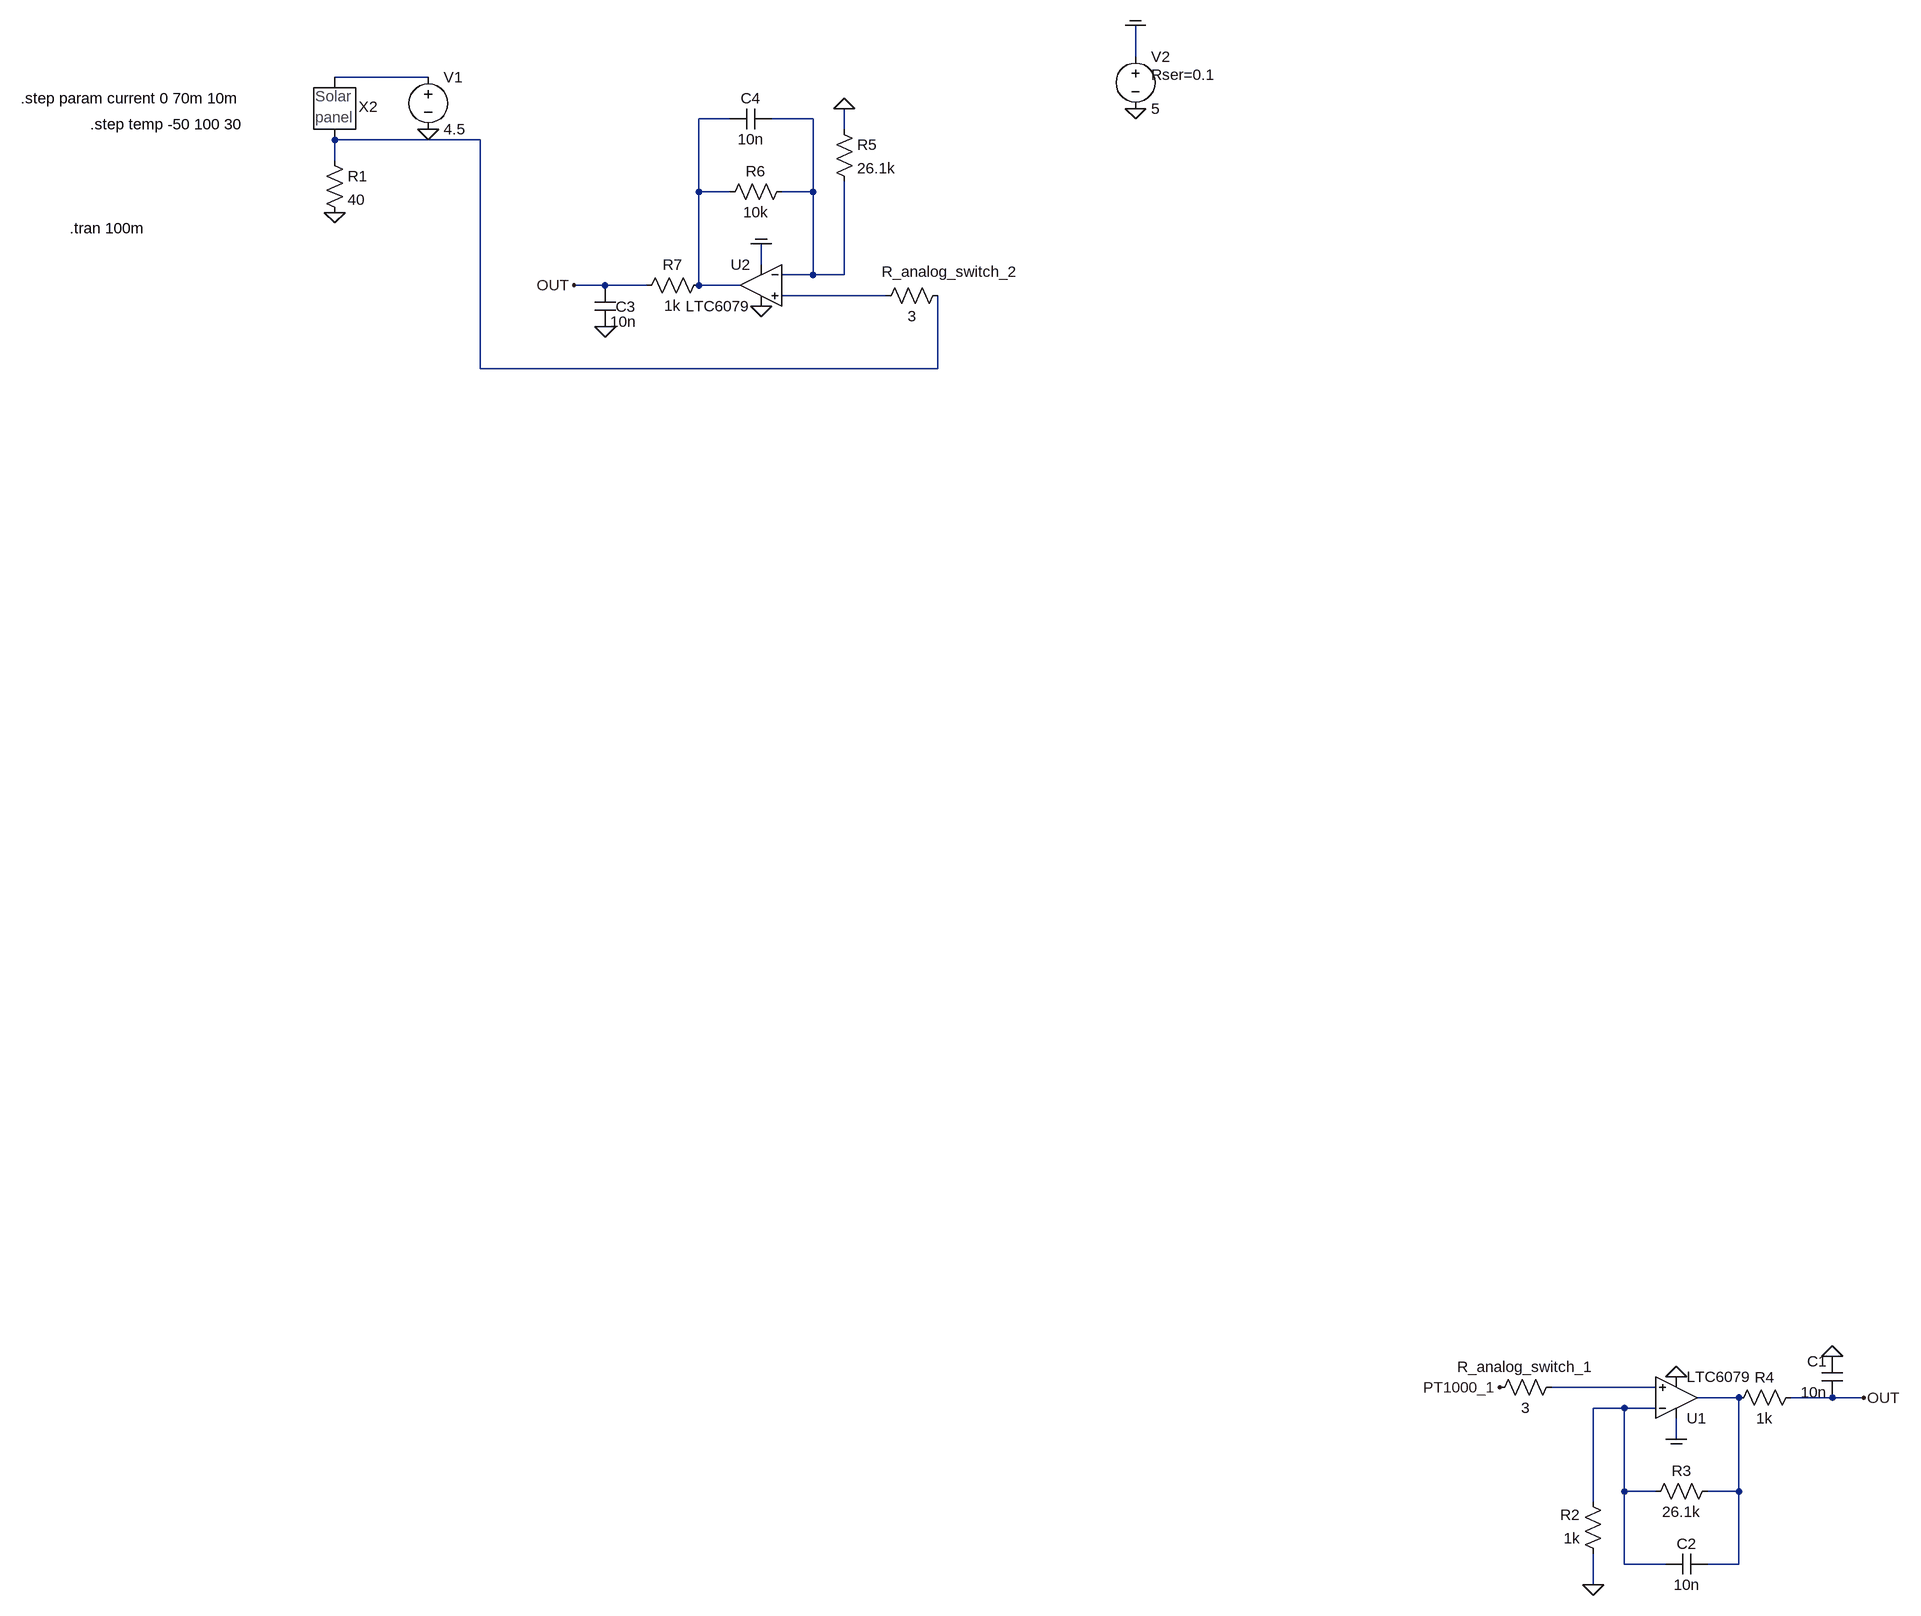
[diagram p0: schematic Uklad.asc]
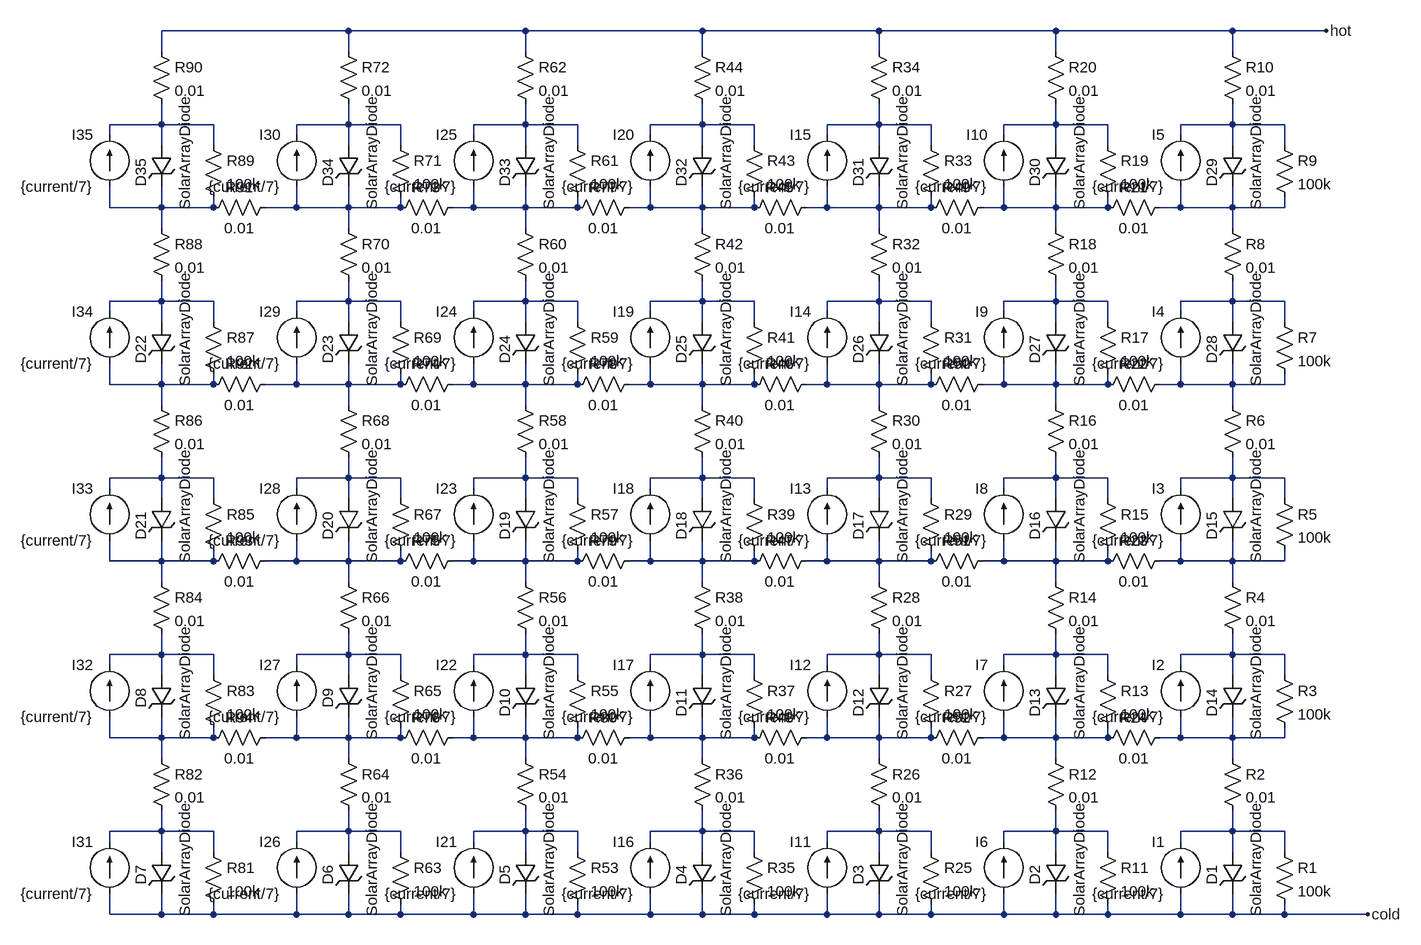
[diagram p1: sub-circuit solar.asc]
Uklad.asc, the LTspice schematic file:
Version 4
SHEET 1 2604 2436
WIRE 1408 64 1408 16
WIRE 320 96 176 96
WIRE 784 160 736 160
WIRE 912 160 848 160
WIRE 960 176 960 144
WIRE 400 192 176 192
WIRE 176 224 176 192
WIRE 736 272 736 160
WIRE 784 272 736 272
WIRE 912 272 912 160
WIRE 912 272 864 272
WIRE 832 384 832 352
WIRE 912 400 912 272
WIRE 912 400 864 400
WIRE 960 400 960 256
WIRE 960 400 912 400
WIRE 592 416 544 416
WIRE 656 416 592 416
WIRE 736 416 736 272
WIRE 800 416 736 416
WIRE 1024 432 864 432
WIRE 400 544 400 192
WIRE 1104 544 1104 432
WIRE 1104 544 400 544
WIRE 2208 2112 2048 2112
WIRE 2336 2128 2272 2128
WIRE 2480 2128 2416 2128
WIRE 2528 2128 2480 2128
WIRE 2160 2144 2112 2144
WIRE 2208 2144 2160 2144
WIRE 2240 2192 2240 2160
WIRE 2160 2272 2160 2144
WIRE 2208 2272 2160 2272
WIRE 2336 2272 2336 2128
WIRE 2336 2272 2288 2272
WIRE 2112 2288 2112 2144
WIRE 2160 2384 2160 2272
WIRE 2224 2384 2160 2384
WIRE 2336 2384 2336 2272
WIRE 2336 2384 2288 2384
WIRE 2112 2416 2112 2368
FLAG 176 304 0
FLAG 320 176 0
FLAG 2240 2096 0
FLAG 2240 2192 COM
FLAG 2112 2416 0
FLAG 2480 2064 0
FLAG 1968 2112 PT1000_1
FLAG 2528 2128 OUT
FLAG 832 448 0
FLAG 832 352 COM
FLAG 960 144 0
FLAG 592 480 0
FLAG 544 416 OUT
FLAG 1408 144 0
FLAG 1408 16 COM
SYMBOL voltage 320 80 R0
WINDOW 123 0 0 Left 2
WINDOW 39 0 0 Left 2
SYMATTR InstName V1
SYMATTR Value 4.5
SYMBOL SOLAR 176 144 R0
SYMATTR InstName X2
SYMBOL res 160 208 R0
SYMATTR InstName R1
SYMATTR Value 40
SYMBOL Opamps\\LTC6079 2240 2128 M180
SYMATTR InstName U1
SYMBOL res 2128 2384 R180
WINDOW 0 36 76 Left 2
WINDOW 3 36 40 Left 2
SYMATTR InstName R2
SYMATTR Value 1k
SYMBOL res 2192 2288 R270
WINDOW 0 32 56 VTop 2
WINDOW 3 0 56 VBottom 2
SYMATTR InstName R3
SYMATTR Value 26.1k
SYMBOL cap 2496 2128 R180
WINDOW 0 24 56 Left 2
WINDOW 3 24 8 Left 2
SYMATTR InstName C1
SYMATTR Value 10n
SYMBOL res 2320 2144 R270
WINDOW 0 32 56 VTop 2
WINDOW 3 0 56 VBottom 2
SYMATTR InstName R4
SYMATTR Value 1k
SYMBOL res 1952 2128 R270
WINDOW 0 32 56 VTop 2
WINDOW 3 0 56 VBottom 2
SYMATTR InstName R_analog_switch_1
SYMATTR Value 3
SYMBOL cap 2224 2400 R270
WINDOW 0 32 32 VTop 2
WINDOW 3 0 32 VBottom 2
SYMATTR InstName C2
SYMATTR Value 10n
SYMBOL Opamps\\LTC6079 832 416 M0
SYMATTR InstName U2
SYMBOL res 944 160 R0
SYMATTR InstName R5
SYMATTR Value 26.1k
SYMBOL res 880 256 R90
WINDOW 0 0 56 VBottom 2
WINDOW 3 32 56 VTop 2
SYMATTR InstName R6
SYMATTR Value 10k
SYMBOL cap 576 416 R0
WINDOW 0 32 33 Left 2
SYMATTR InstName C3
SYMATTR Value 10n
SYMBOL res 752 400 R90
WINDOW 0 0 56 VBottom 2
WINDOW 3 32 56 VTop 2
SYMATTR InstName R7
SYMATTR Value 1k
SYMBOL res 1120 416 R90
WINDOW 0 -5 -3 VBottom 2
WINDOW 3 32 56 VTop 2
SYMATTR InstName R_analog_switch_2
SYMATTR Value 3
SYMBOL cap 848 144 R90
WINDOW 0 0 32 VBottom 2
WINDOW 3 32 32 VTop 2
SYMATTR InstName C4
SYMATTR Value 10n
SYMBOL voltage 1408 48 R0
WINDOW 123 0 0 Left 2
WINDOW 39 24 44 Left 2
SYMATTR SpiceLine Rser=0.1
SYMATTR InstName V2
SYMATTR Value 5
TEXT 32 128 Right 2 !.step param current 0 70m 10m
TEXT -200 168 Left 2 !.step temp -50 100 30
TEXT -232 328 Left 2 !.tran 100m

solar.asc, the sub-circuit schematic file:
Version 4
SHEET 1 880 680
WIRE -1744 -1248 -2032 -1248
WIRE -1472 -1248 -1744 -1248
WIRE -1200 -1248 -1472 -1248
WIRE -928 -1248 -1200 -1248
WIRE -656 -1248 -928 -1248
WIRE -384 -1248 -656 -1248
WIRE -240 -1248 -384 -1248
WIRE -2032 -1216 -2032 -1248
WIRE -1744 -1216 -1744 -1248
WIRE -1472 -1216 -1472 -1248
WIRE -1200 -1216 -1200 -1248
WIRE -928 -1216 -928 -1248
WIRE -656 -1216 -656 -1248
WIRE -384 -1216 -384 -1248
WIRE -2032 -1104 -2032 -1136
WIRE -2032 -1104 -2112 -1104
WIRE -1952 -1104 -2032 -1104
WIRE -1744 -1104 -1744 -1136
WIRE -1744 -1104 -1824 -1104
WIRE -1664 -1104 -1744 -1104
WIRE -1472 -1104 -1472 -1136
WIRE -1472 -1104 -1552 -1104
WIRE -1392 -1104 -1472 -1104
WIRE -1200 -1104 -1200 -1136
WIRE -1200 -1104 -1280 -1104
WIRE -1120 -1104 -1200 -1104
WIRE -928 -1104 -928 -1136
WIRE -928 -1104 -1008 -1104
WIRE -848 -1104 -928 -1104
WIRE -656 -1104 -656 -1136
WIRE -656 -1104 -736 -1104
WIRE -576 -1104 -656 -1104
WIRE -384 -1104 -384 -1136
WIRE -384 -1104 -464 -1104
WIRE -304 -1104 -384 -1104
WIRE -2112 -1088 -2112 -1104
WIRE -1824 -1088 -1824 -1104
WIRE -1552 -1088 -1552 -1104
WIRE -1280 -1088 -1280 -1104
WIRE -1008 -1088 -1008 -1104
WIRE -736 -1088 -736 -1104
WIRE -464 -1088 -464 -1104
WIRE -2032 -1072 -2032 -1104
WIRE -1952 -1072 -1952 -1104
WIRE -1744 -1072 -1744 -1104
WIRE -1664 -1072 -1664 -1104
WIRE -1472 -1072 -1472 -1104
WIRE -1392 -1072 -1392 -1104
WIRE -1200 -1072 -1200 -1104
WIRE -1120 -1072 -1120 -1104
WIRE -928 -1072 -928 -1104
WIRE -848 -1072 -848 -1104
WIRE -656 -1072 -656 -1104
WIRE -576 -1072 -576 -1104
WIRE -384 -1072 -384 -1104
WIRE -304 -1072 -304 -1104
WIRE -2112 -976 -2112 -1008
WIRE -2032 -976 -2032 -1008
WIRE -2032 -976 -2112 -976
WIRE -1952 -976 -1952 -992
WIRE -1952 -976 -2032 -976
WIRE -1824 -976 -1824 -1008
WIRE -1824 -976 -1872 -976
WIRE -1744 -976 -1744 -1008
WIRE -1744 -976 -1824 -976
WIRE -1664 -976 -1664 -992
WIRE -1664 -976 -1744 -976
WIRE -1552 -976 -1552 -1008
WIRE -1552 -976 -1584 -976
WIRE -1472 -976 -1472 -1008
WIRE -1472 -976 -1552 -976
WIRE -1392 -976 -1392 -992
WIRE -1392 -976 -1472 -976
WIRE -1280 -976 -1280 -1008
WIRE -1280 -976 -1312 -976
WIRE -1200 -976 -1200 -1008
WIRE -1200 -976 -1280 -976
WIRE -1120 -976 -1120 -992
WIRE -1120 -976 -1200 -976
WIRE -1008 -976 -1008 -1008
WIRE -1008 -976 -1040 -976
WIRE -928 -976 -928 -1008
WIRE -928 -976 -1008 -976
WIRE -848 -976 -848 -992
WIRE -848 -976 -928 -976
WIRE -736 -976 -736 -1008
WIRE -736 -976 -768 -976
WIRE -656 -976 -656 -1008
WIRE -656 -976 -736 -976
WIRE -576 -976 -576 -992
WIRE -576 -976 -656 -976
WIRE -464 -976 -464 -1008
WIRE -464 -976 -496 -976
WIRE -384 -976 -384 -1008
WIRE -384 -976 -464 -976
WIRE -304 -976 -304 -992
WIRE -304 -976 -384 -976
WIRE -2032 -944 -2032 -976
WIRE -1744 -944 -1744 -976
WIRE -1472 -944 -1472 -976
WIRE -1200 -944 -1200 -976
WIRE -928 -944 -928 -976
WIRE -656 -944 -656 -976
WIRE -384 -944 -384 -976
WIRE -2032 -832 -2032 -864
WIRE -2032 -832 -2112 -832
WIRE -1952 -832 -2032 -832
WIRE -1744 -832 -1744 -864
WIRE -1744 -832 -1824 -832
WIRE -1664 -832 -1744 -832
WIRE -1472 -832 -1472 -864
WIRE -1472 -832 -1552 -832
WIRE -1392 -832 -1472 -832
WIRE -1200 -832 -1200 -864
WIRE -1200 -832 -1280 -832
WIRE -1120 -832 -1200 -832
WIRE -928 -832 -928 -864
WIRE -928 -832 -1008 -832
WIRE -848 -832 -928 -832
WIRE -656 -832 -656 -864
WIRE -656 -832 -736 -832
WIRE -576 -832 -656 -832
WIRE -384 -832 -384 -864
WIRE -384 -832 -464 -832
WIRE -304 -832 -384 -832
WIRE -2112 -816 -2112 -832
WIRE -1824 -816 -1824 -832
WIRE -1552 -816 -1552 -832
WIRE -1280 -816 -1280 -832
WIRE -1008 -816 -1008 -832
WIRE -736 -816 -736 -832
WIRE -464 -816 -464 -832
WIRE -2032 -800 -2032 -832
WIRE -1952 -800 -1952 -832
WIRE -1744 -800 -1744 -832
WIRE -1664 -800 -1664 -832
WIRE -1472 -800 -1472 -832
WIRE -1392 -800 -1392 -832
WIRE -1200 -800 -1200 -832
WIRE -1120 -800 -1120 -832
WIRE -928 -800 -928 -832
WIRE -848 -800 -848 -832
WIRE -656 -800 -656 -832
WIRE -576 -800 -576 -832
WIRE -384 -800 -384 -832
WIRE -304 -800 -304 -832
WIRE -2112 -704 -2112 -736
WIRE -2032 -704 -2032 -736
WIRE -2032 -704 -2112 -704
WIRE -1952 -704 -1952 -720
WIRE -1952 -704 -2032 -704
WIRE -1824 -704 -1824 -736
WIRE -1824 -704 -1872 -704
WIRE -1744 -704 -1744 -736
WIRE -1744 -704 -1824 -704
WIRE -1664 -704 -1664 -720
WIRE -1664 -704 -1744 -704
WIRE -1552 -704 -1552 -736
WIRE -1552 -704 -1584 -704
WIRE -1472 -704 -1472 -736
WIRE -1472 -704 -1552 -704
WIRE -1392 -704 -1392 -720
WIRE -1392 -704 -1472 -704
WIRE -1280 -704 -1280 -736
WIRE -1280 -704 -1312 -704
WIRE -1200 -704 -1200 -736
WIRE -1200 -704 -1280 -704
WIRE -1120 -704 -1120 -720
WIRE -1120 -704 -1200 -704
WIRE -1008 -704 -1008 -736
WIRE -1008 -704 -1040 -704
WIRE -928 -704 -928 -736
WIRE -928 -704 -1008 -704
WIRE -848 -704 -848 -720
WIRE -848 -704 -928 -704
WIRE -736 -704 -736 -736
WIRE -736 -704 -768 -704
WIRE -656 -704 -656 -736
WIRE -656 -704 -736 -704
WIRE -576 -704 -576 -720
WIRE -576 -704 -656 -704
WIRE -464 -704 -464 -736
WIRE -464 -704 -496 -704
WIRE -384 -704 -384 -736
WIRE -384 -704 -464 -704
WIRE -304 -704 -304 -720
WIRE -304 -704 -384 -704
WIRE -2032 -672 -2032 -704
WIRE -1744 -672 -1744 -704
WIRE -1472 -672 -1472 -704
WIRE -1200 -672 -1200 -704
WIRE -928 -672 -928 -704
WIRE -656 -672 -656 -704
WIRE -384 -672 -384 -704
WIRE -2032 -560 -2032 -592
WIRE -2032 -560 -2112 -560
WIRE -1952 -560 -2032 -560
WIRE -1744 -560 -1744 -592
WIRE -1744 -560 -1824 -560
WIRE -1664 -560 -1744 -560
WIRE -1472 -560 -1472 -592
WIRE -1472 -560 -1552 -560
WIRE -1392 -560 -1472 -560
WIRE -1200 -560 -1200 -592
WIRE -1200 -560 -1280 -560
WIRE -1120 -560 -1200 -560
WIRE -928 -560 -928 -592
WIRE -928 -560 -1008 -560
WIRE -848 -560 -928 -560
WIRE -656 -560 -656 -592
WIRE -656 -560 -736 -560
WIRE -576 -560 -656 -560
WIRE -384 -560 -384 -592
WIRE -384 -560 -464 -560
WIRE -304 -560 -384 -560
WIRE -2112 -544 -2112 -560
WIRE -1824 -544 -1824 -560
WIRE -1552 -544 -1552 -560
WIRE -1280 -544 -1280 -560
WIRE -1008 -544 -1008 -560
WIRE -736 -544 -736 -560
WIRE -464 -544 -464 -560
WIRE -2032 -528 -2032 -560
WIRE -1952 -528 -1952 -560
WIRE -1744 -528 -1744 -560
WIRE -1664 -528 -1664 -560
WIRE -1472 -528 -1472 -560
WIRE -1392 -528 -1392 -560
WIRE -1200 -528 -1200 -560
WIRE -1120 -528 -1120 -560
WIRE -928 -528 -928 -560
WIRE -848 -528 -848 -560
WIRE -656 -528 -656 -560
WIRE -576 -528 -576 -560
WIRE -384 -528 -384 -560
WIRE -304 -528 -304 -560
WIRE -2112 -432 -2112 -464
WIRE -2032 -432 -2032 -464
WIRE -2032 -432 -2112 -432
WIRE -1952 -432 -1952 -448
WIRE -1952 -432 -2032 -432
WIRE -1824 -432 -1824 -464
WIRE -1824 -432 -1872 -432
WIRE -1744 -432 -1744 -464
WIRE -1744 -432 -1824 -432
WIRE -1664 -432 -1664 -448
WIRE -1664 -432 -1744 -432
WIRE -1552 -432 -1552 -464
WIRE -1552 -432 -1584 -432
WIRE -1472 -432 -1472 -464
WIRE -1472 -432 -1552 -432
WIRE -1392 -432 -1392 -448
WIRE -1392 -432 -1472 -432
WIRE -1280 -432 -1280 -464
WIRE -1280 -432 -1312 -432
WIRE -1200 -432 -1200 -464
WIRE -1200 -432 -1280 -432
WIRE -1120 -432 -1120 -448
WIRE -1120 -432 -1200 -432
WIRE -1008 -432 -1008 -464
WIRE -1008 -432 -1040 -432
WIRE -928 -432 -928 -464
WIRE -928 -432 -1008 -432
WIRE -848 -432 -848 -448
WIRE -848 -432 -928 -432
WIRE -736 -432 -736 -464
WIRE -736 -432 -768 -432
WIRE -656 -432 -656 -464
WIRE -656 -432 -736 -432
WIRE -576 -432 -576 -448
WIRE -576 -432 -656 -432
WIRE -464 -432 -464 -464
WIRE -464 -432 -496 -432
WIRE -384 -432 -384 -464
WIRE -384 -432 -464 -432
WIRE -304 -432 -304 -448
WIRE -304 -432 -384 -432
WIRE -2032 -400 -2032 -432
WIRE -1744 -400 -1744 -432
WIRE -1472 -400 -1472 -432
WIRE -1200 -400 -1200 -432
WIRE -928 -400 -928 -432
WIRE -656 -400 -656 -432
WIRE -384 -400 -384 -432
WIRE -2032 -288 -2032 -320
WIRE -2032 -288 -2112 -288
WIRE -1952 -288 -2032 -288
WIRE -1744 -288 -1744 -320
WIRE -1744 -288 -1824 -288
WIRE -1664 -288 -1744 -288
WIRE -1472 -288 -1472 -320
WIRE -1472 -288 -1552 -288
WIRE -1392 -288 -1472 -288
WIRE -1200 -288 -1200 -320
WIRE -1200 -288 -1280 -288
WIRE -1120 -288 -1200 -288
WIRE -928 -288 -928 -320
WIRE -928 -288 -1008 -288
WIRE -848 -288 -928 -288
WIRE -656 -288 -656 -320
WIRE -656 -288 -736 -288
WIRE -576 -288 -656 -288
WIRE -384 -288 -384 -320
WIRE -384 -288 -464 -288
WIRE -304 -288 -384 -288
WIRE -2112 -272 -2112 -288
WIRE -1824 -272 -1824 -288
WIRE -1552 -272 -1552 -288
WIRE -1280 -272 -1280 -288
WIRE -1008 -272 -1008 -288
WIRE -736 -272 -736 -288
WIRE -464 -272 -464 -288
WIRE -2032 -256 -2032 -288
WIRE -1952 -256 -1952 -288
WIRE -1744 -256 -1744 -288
WIRE -1664 -256 -1664 -288
WIRE -1472 -256 -1472 -288
WIRE -1392 -256 -1392 -288
WIRE -1200 -256 -1200 -288
WIRE -1120 -256 -1120 -288
WIRE -928 -256 -928 -288
WIRE -848 -256 -848 -288
WIRE -656 -256 -656 -288
WIRE -576 -256 -576 -288
WIRE -384 -256 -384 -288
WIRE -304 -256 -304 -288
WIRE -2112 -160 -2112 -192
WIRE -2032 -160 -2032 -192
WIRE -2032 -160 -2112 -160
WIRE -1952 -160 -1952 -176
WIRE -1952 -160 -2032 -160
WIRE -1824 -160 -1824 -192
WIRE -1824 -160 -1872 -160
WIRE -1744 -160 -1744 -192
WIRE -1744 -160 -1824 -160
WIRE -1664 -160 -1664 -176
WIRE -1664 -160 -1744 -160
WIRE -1552 -160 -1552 -192
WIRE -1552 -160 -1584 -160
WIRE -1472 -160 -1472 -192
WIRE -1472 -160 -1552 -160
WIRE -1392 -160 -1392 -176
WIRE -1392 -160 -1472 -160
WIRE -1280 -160 -1280 -192
WIRE -1280 -160 -1312 -160
WIRE -1200 -160 -1200 -192
WIRE -1200 -160 -1280 -160
WIRE -1120 -160 -1120 -176
WIRE -1120 -160 -1200 -160
WIRE -1008 -160 -1008 -192
WIRE -1008 -160 -1040 -160
WIRE -928 -160 -928 -192
WIRE -928 -160 -1008 -160
WIRE -848 -160 -848 -176
WIRE -848 -160 -928 -160
WIRE -736 -160 -736 -192
WIRE -736 -160 -768 -160
WIRE -656 -160 -656 -192
WIRE -656 -160 -736 -160
WIRE -576 -160 -576 -176
WIRE -576 -160 -656 -160
WIRE -464 -160 -464 -192
WIRE -464 -160 -496 -160
WIRE -384 -160 -384 -192
WIRE -384 -160 -464 -160
WIRE -304 -160 -304 -176
WIRE -304 -160 -384 -160
WIRE -2032 -128 -2032 -160
WIRE -1744 -128 -1744 -160
WIRE -1472 -128 -1472 -160
WIRE -1200 -128 -1200 -160
WIRE -928 -128 -928 -160
WIRE -656 -128 -656 -160
WIRE -384 -128 -384 -160
WIRE -2032 -16 -2032 -48
WIRE -2032 -16 -2112 -16
WIRE -1952 -16 -2032 -16
WIRE -1744 -16 -1744 -48
WIRE -1744 -16 -1824 -16
WIRE -1664 -16 -1744 -16
WIRE -1472 -16 -1472 -48
WIRE -1472 -16 -1552 -16
WIRE -1392 -16 -1472 -16
WIRE -1200 -16 -1200 -48
WIRE -1200 -16 -1280 -16
WIRE -1120 -16 -1200 -16
WIRE -928 -16 -928 -48
WIRE -928 -16 -1008 -16
WIRE -848 -16 -928 -16
WIRE -656 -16 -656 -48
WIRE -656 -16 -736 -16
WIRE -576 -16 -656 -16
WIRE -384 -16 -384 -48
WIRE -384 -16 -464 -16
WIRE -304 -16 -384 -16
WIRE -2112 0 -2112 -16
WIRE -1824 0 -1824 -16
WIRE -1552 0 -1552 -16
WIRE -1280 0 -1280 -16
WIRE -1008 0 -1008 -16
WIRE -736 0 -736 -16
WIRE -464 0 -464 -16
WIRE -2032 16 -2032 -16
WIRE -1952 16 -1952 -16
WIRE -1744 16 -1744 -16
WIRE -1664 16 -1664 -16
WIRE -1472 16 -1472 -16
WIRE -1392 16 -1392 -16
WIRE -1200 16 -1200 -16
WIRE -1120 16 -1120 -16
WIRE -928 16 -928 -16
WIRE -848 16 -848 -16
WIRE -656 16 -656 -16
WIRE -576 16 -576 -16
WIRE -384 16 -384 -16
WIRE -304 16 -304 -16
WIRE -2112 112 -2112 80
WIRE -2032 112 -2032 80
WIRE -2032 112 -2112 112
WIRE -1952 112 -1952 96
WIRE -1952 112 -2032 112
WIRE -1824 112 -1824 80
WIRE -1824 112 -1952 112
WIRE -1744 112 -1744 80
WIRE -1744 112 -1824 112
WIRE -1664 112 -1664 96
WIRE -1664 112 -1744 112
WIRE -1552 112 -1552 80
WIRE -1552 112 -1664 112
WIRE -1472 112 -1472 80
WIRE -1472 112 -1552 112
WIRE -1392 112 -1392 96
WIRE -1392 112 -1472 112
WIRE -1280 112 -1280 80
WIRE -1280 112 -1392 112
WIRE -1200 112 -1200 80
WIRE -1200 112 -1280 112
WIRE -1120 112 -1120 96
WIRE -1120 112 -1200 112
WIRE -1008 112 -1008 80
WIRE -1008 112 -1120 112
WIRE -928 112 -928 80
WIRE -928 112 -1008 112
WIRE -848 112 -848 96
WIRE -848 112 -928 112
WIRE -736 112 -736 80
WIRE -736 112 -848 112
WIRE -656 112 -656 80
WIRE -656 112 -736 112
WIRE -576 112 -576 96
WIRE -576 112 -656 112
WIRE -464 112 -464 80
WIRE -464 112 -576 112
WIRE -384 112 -384 80
WIRE -384 112 -464 112
WIRE -304 112 -304 96
WIRE -304 112 -384 112
WIRE -176 112 -304 112
FLAG -240 -1248 hot
FLAG -176 112 cold
SYMBOL current -464 80 R180
WINDOW 0 24 80 Left 2
WINDOW 3 24 0 Left 2
WINDOW 123 0 0 Left 2
WINDOW 39 0 0 Left 2
SYMATTR InstName I1
SYMATTR Value {current/7}
SYMBOL zener -400 16 R0
WINDOW 0 -16 20 VRight 2
WINDOW 3 52 99 VLeft 2
SYMATTR InstName D1
SYMATTR Value SolarArrayDiode
SYMATTR Description Diode
SYMATTR Type diode
SYMBOL res -320 0 R0
SYMATTR InstName R1
SYMATTR Value 100k
SYMBOL res -400 -144 R0
SYMATTR InstName R2
SYMATTR Value 0.01
SYMBOL current -464 -192 R180
WINDOW 0 24 80 Left 2
WINDOW 3 24 0 Left 2
WINDOW 123 0 0 Left 2
WINDOW 39 0 0 Left 2
SYMATTR InstName I2
SYMATTR Value {current/7}
SYMBOL res -320 -272 R0
SYMATTR InstName R3
SYMATTR Value 100k
SYMBOL res -400 -416 R0
SYMATTR InstName R4
SYMATTR Value 0.01
SYMBOL current -464 -464 R180
WINDOW 0 24 80 Left 2
WINDOW 3 24 0 Left 2
WINDOW 123 0 0 Left 2
WINDOW 39 0 0 Left 2
SYMATTR InstName I3
SYMATTR Value {current/7}
SYMBOL res -320 -544 R0
SYMATTR InstName R5
SYMATTR Value 100k
SYMBOL res -400 -688 R0
SYMATTR InstName R6
SYMATTR Value 0.01
SYMBOL current -464 -736 R180
WINDOW 0 24 80 Left 2
WINDOW 3 24 0 Left 2
WINDOW 123 0 0 Left 2
WINDOW 39 0 0 Left 2
SYMATTR InstName I4
SYMATTR Value {current/7}
SYMBOL res -320 -816 R0
SYMATTR InstName R7
SYMATTR Value 100k
SYMBOL res -400 -960 R0
SYMATTR InstName R8
SYMATTR Value 0.01
SYMBOL current -464 -1008 R180
WINDOW 0 24 80 Left 2
WINDOW 3 24 0 Left 2
WINDOW 123 0 0 Left 2
WINDOW 39 0 0 Left 2
SYMATTR InstName I5
SYMATTR Value {current/7}
SYMBOL res -320 -1088 R0
SYMATTR InstName R9
SYMATTR Value 100k
SYMBOL res -400 -1232 R0
SYMATTR InstName R10
SYMATTR Value 0.01
SYMBOL current -736 80 R180
WINDOW 0 24 80 Left 2
WINDOW 3 24 0 Left 2
WINDOW 123 0 0 Left 2
WINDOW 39 0 0 Left 2
SYMATTR InstName I6
SYMATTR Value {current/7}
SYMBOL zener -672 16 R0
WINDOW 0 -16 20 VRight 2
WINDOW 3 52 99 VLeft 2
SYMATTR InstName D2
SYMATTR Value SolarArrayDiode
SYMATTR Description Diode
SYMATTR Type diode
SYMBOL res -592 0 R0
SYMATTR InstName R11
SYMATTR Value 100k
SYMBOL res -672 -144 R0
SYMATTR InstName R12
SYMATTR Value 0.01
SYMBOL current -736 -192 R180
WINDOW 0 24 80 Left 2
WINDOW 3 24 0 Left 2
WINDOW 123 0 0 Left 2
WINDOW 39 0 0 Left 2
SYMATTR InstName I7
SYMATTR Value {current/7}
SYMBOL res -592 -272 R0
SYMATTR InstName R13
SYMATTR Value 100k
SYMBOL res -672 -416 R0
SYMATTR InstName R14
SYMATTR Value 0.01
SYMBOL current -736 -464 R180
WINDOW 0 24 80 Left 2
WINDOW 3 24 0 Left 2
WINDOW 123 0 0 Left 2
WINDOW 39 0 0 Left 2
SYMATTR InstName I8
SYMATTR Value {current/7}
SYMBOL res -592 -544 R0
SYMATTR InstName R15
SYMATTR Value 100k
SYMBOL res -672 -688 R0
SYMATTR InstName R16
SYMATTR Value 0.01
SYMBOL current -736 -736 R180
WINDOW 0 24 80 Left 2
WINDOW 3 24 0 Left 2
WINDOW 123 0 0 Left 2
WINDOW 39 0 0 Left 2
SYMATTR InstName I9
SYMATTR Value {current/7}
SYMBOL res -592 -816 R0
SYMATTR InstName R17
SYMATTR Value 100k
SYMBOL res -672 -960 R0
SYMATTR InstName R18
SYMATTR Value 0.01
SYMBOL current -736 -1008 R180
WINDOW 0 24 80 Left 2
WINDOW 3 24 0 Left 2
WINDOW 123 0 0 Left 2
WINDOW 39 0 0 Left 2
SYMATTR InstName I10
SYMATTR Value {current/7}
SYMBOL res -592 -1088 R0
SYMATTR InstName R19
SYMATTR Value 100k
SYMBOL res -672 -1232 R0
SYMATTR InstName R20
SYMATTR Value 0.01
SYMBOL res -480 -992 R90
WINDOW 0 0 56 VBottom 2
WINDOW 3 32 56 VTop 2
SYMATTR InstName R21
SYMATTR Value 0.01
SYMBOL res -480 -720 R90
WINDOW 0 0 56 VBottom 2
WINDOW 3 32 56 VTop 2
SYMATTR InstName R22
SYMATTR Value 0.01
SYMBOL res -480 -448 R90
WINDOW 0 0 56 VBottom 2
WINDOW 3 32 56 VTop 2
SYMATTR InstName R23
SYMATTR Value 0.01
SYMBOL res -480 -176 R90
WINDOW 0 0 56 VBottom 2
WINDOW 3 32 56 VTop 2
SYMATTR InstName R24
SYMATTR Value 0.01
SYMBOL current -1008 80 R180
WINDOW 0 24 80 Left 2
WINDOW 3 24 0 Left 2
WINDOW 123 0 0 Left 2
WINDOW 39 0 0 Left 2
SYMATTR InstName I11
SYMATTR Value {current/7}
SYMBOL res -864 0 R0
SYMATTR InstName R25
SYMATTR Value 100k
SYMBOL res -944 -144 R0
SYMATTR InstName R26
SYMATTR Value 0.01
SYMBOL current -1008 -192 R180
WINDOW 0 24 80 Left 2
WINDOW 3 24 0 Left 2
WINDOW 123 0 0 Left 2
WINDOW 39 0 0 Left 2
SYMATTR InstName I12
SYMATTR Value {current/7}
SYMBOL res -864 -272 R0
SYMATTR InstName R27
SYMATTR Value 100k
SYMBOL res -944 -416 R0
SYMATTR InstName R28
SYMATTR Value 0.01
SYMBOL current -1008 -464 R180
WINDOW 0 24 80 Left 2
WINDOW 3 24 0 Left 2
WINDOW 123 0 0 Left 2
WINDOW 39 0 0 Left 2
SYMATTR InstName I13
SYMATTR Value {current/7}
SYMBOL res -864 -544 R0
SYMATTR InstName R29
SYMATTR Value 100k
SYMBOL res -944 -688 R0
SYMATTR InstName R30
SYMATTR Value 0.01
SYMBOL current -1008 -736 R180
WINDOW 0 24 80 Left 2
WINDOW 3 24 0 Left 2
WINDOW 123 0 0 Left 2
WINDOW 39 0 0 Left 2
SYMATTR InstName I14
SYMATTR Value {current/7}
SYMBOL res -864 -816 R0
SYMATTR InstName R31
SYMATTR Value 100k
SYMBOL res -944 -960 R0
SYMATTR InstName R32
SYMATTR Value 0.01
SYMBOL current -1008 -1008 R180
WINDOW 0 24 80 Left 2
WINDOW 3 24 0 Left 2
WINDOW 123 0 0 Left 2
WINDOW 39 0 0 Left 2
SYMATTR InstName I15
SYMATTR Value {current/7}
SYMBOL res -864 -1088 R0
SYMATTR InstName R33
SYMATTR Value 100k
SYMBOL res -944 -1232 R0
SYMATTR InstName R34
SYMATTR Value 0.01
SYMBOL current -1280 80 R180
WINDOW 0 24 80 Left 2
WINDOW 3 24 0 Left 2
WINDOW 123 0 0 Left 2
WINDOW 39 0 0 Left 2
SYMATTR InstName I16
SYMATTR Value {current/7}
SYMBOL res -1136 0 R0
SYMATTR InstName R35
SYMATTR Value 100k
SYMBOL res -1216 -144 R0
SYMATTR InstName R36
SYMATTR Value 0.01
SYMBOL current -1280 -192 R180
WINDOW 0 24 80 Left 2
WINDOW 3 24 0 Left 2
WINDOW 123 0 0 Left 2
WINDOW 39 0 0 Left 2
SYMATTR InstName I17
SYMATTR Value {current/7}
SYMBOL res -1136 -272 R0
SYMATTR InstName R37
SYMATTR Value 100k
SYMBOL res -1216 -416 R0
SYMATTR InstName R38
SYMATTR Value 0.01
SYMBOL current -1280 -464 R180
WINDOW 0 24 80 Left 2
WINDOW 3 24 0 Left 2
WINDOW 123 0 0 Left 2
WINDOW 39 0 0 Left 2
SYMATTR InstName I18
SYMATTR Value {current/7}
SYMBOL res -1136 -544 R0
SYMATTR InstName R39
SYMATTR Value 100k
SYMBOL res -1216 -688 R0
SYMATTR InstName R40
SYMATTR Value 0.01
SYMBOL current -1280 -736 R180
WINDOW 0 24 80 Left 2
WINDOW 3 24 0 Left 2
WINDOW 123 0 0 Left 2
WINDOW 39 0 0 Left 2
SYMATTR InstName I19
SYMATTR Value {current/7}
SYMBOL res -1136 -816 R0
SYMATTR InstName R41
SYMATTR Value 100k
SYMBOL res -1216 -960 R0
SYMATTR InstName R42
SYMATTR Value 0.01
SYMBOL current -1280 -1008 R180
WINDOW 0 24 80 Left 2
WINDOW 3 24 0 Left 2
WINDOW 123 0 0 Left 2
WINDOW 39 0 0 Left 2
SYMATTR InstName I20
SYMATTR Value {current/7}
SYMBOL res -1136 -1088 R0
SYMATTR InstName R43
SYMATTR Value 100k
SYMBOL res -1216 -1232 R0
SYMATTR InstName R44
SYMATTR Value 0.01
SYMBOL res -1024 -992 R90
WINDOW 0 0 56 VBottom 2
WINDOW 3 32 56 VTop 2
SYMATTR InstName R45
SYMATTR Value 0.01
SYMBOL res -1024 -720 R90
WINDOW 0 0 56 VBottom 2
WINDOW 3 32 56 VTop 2
SYMATTR InstName R46
SYMATTR Value 0.01
SYMBOL res -1024 -448 R90
WINDOW 0 0 56 VBottom 2
WINDOW 3 32 56 VTop 2
SYMATTR InstName R47
SYMATTR Value 0.01
SYMBOL res -1024 -176 R90
WINDOW 0 0 56 VBottom 2
WINDOW 3 32 56 VTop 2
SYMATTR InstName R48
SYMATTR Value 0.01
SYMBOL res -752 -992 R90
WINDOW 0 0 56 VBottom 2
WINDOW 3 32 56 VTop 2
SYMATTR InstName R49
SYMATTR Value 0.01
SYMBOL res -752 -720 R90
WINDOW 0 0 56 VBottom 2
WINDOW 3 32 56 VTop 2
SYMATTR InstName R50
SYMATTR Value 0.01
SYMBOL res -752 -448 R90
WINDOW 0 0 56 VBottom 2
WINDOW 3 32 56 VTop 2
SYMATTR InstName R51
SYMATTR Value 0.01
SYMBOL res -752 -176 R90
WINDOW 0 0 56 VBottom 2
WINDOW 3 32 56 VTop 2
SYMATTR InstName R52
SYMATTR Value 0.01
SYMBOL current -1552 80 R180
WINDOW 0 24 80 Left 2
WINDOW 3 24 0 Left 2
WINDOW 123 0 0 Left 2
WINDOW 39 0 0 Left 2
SYMATTR InstName I21
SYMATTR Value {current/7}
SYMBOL res -1408 0 R0
SYMATTR InstName R53
SYMATTR Value 100k
SYMBOL res -1488 -144 R0
SYMATTR InstName R54
SYMATTR Value 0.01
SYMBOL current -1552 -192 R180
WINDOW 0 24 80 Left 2
WINDOW 3 24 0 Left 2
WINDOW 123 0 0 Left 2
WINDOW 39 0 0 Left 2
SYMATTR InstName I22
SYMATTR Value {current/7}
SYMBOL res -1408 -272 R0
SYMATTR InstName R55
SYMATTR Value 100k
SYMBOL res -1488 -416 R0
SYMATTR InstName R56
SYMATTR Value 0.01
SYMBOL current -1552 -464 R180
WINDOW 0 24 80 Left 2
WINDOW 3 24 0 Left 2
WINDOW 123 0 0 Left 2
WINDOW 39 0 0 Left 2
SYMATTR InstName I23
SYMATTR Value {current/7}
SYMBOL res -1408 -544 R0
SYMATTR InstName R57
SYMATTR Value 100k
SYMBOL res -1488 -688 R0
SYMATTR InstName R58
SYMATTR Value 0.01
SYMBOL current -1552 -736 R180
WINDOW 0 24 80 Left 2
WINDOW 3 24 0 Left 2
WINDOW 123 0 0 Left 2
WINDOW 39 0 0 Left 2
SYMATTR InstName I24
SYMATTR Value {current/7}
SYMBOL res -1408 -816 R0
SYMATTR InstName R59
SYMATTR Value 100k
SYMBOL res -1488 -960 R0
SYMATTR InstName R60
SYMATTR Value 0.01
SYMBOL current -1552 -1008 R180
WINDOW 0 24 80 Left 2
WINDOW 3 24 0 Left 2
WINDOW 123 0 0 Left 2
WINDOW 39 0 0 Left 2
SYMATTR InstName I25
SYMATTR Value {current/7}
SYMBOL res -1408 -1088 R0
SYMATTR InstName R61
SYMATTR Value 100k
SYMBOL res -1488 -1232 R0
SYMATTR InstName R62
SYMATTR Value 0.01
SYMBOL current -1824 80 R180
WINDOW 0 24 80 Left 2
WINDOW 3 24 0 Left 2
WINDOW 123 0 0 Left 2
WINDOW 39 0 0 Left 2
SYMATTR InstName I26
SYMATTR Value {current/7}
SYMBOL res -1680 0 R0
SYMATTR InstName R63
SYMATTR Value 100k
SYMBOL res -1760 -144 R0
SYMATTR InstName R64
SYMATTR Value 0.01
SYMBOL current -1824 -192 R180
WINDOW 0 24 80 Left 2
WINDOW 3 24 0 Left 2
WINDOW 123 0 0 Left 2
WINDOW 39 0 0 Left 2
SYMATTR InstName I27
SYMATTR Value {current/7}
SYMBOL res -1680 -272 R0
SYMATTR InstName R65
SYMATTR Value 100k
SYMBOL res -1760 -416 R0
SYMATTR InstName R66
SYMATTR Value 0.01
SYMBOL current -1824 -464 R180
WINDOW 0 24 80 Left 2
WINDOW 3 24 0 Left 2
WINDOW 123 0 0 Left 2
WINDOW 39 0 0 Left 2
SYMATTR InstName I28
SYMATTR Value {current/7}
SYMBOL res -1680 -544 R0
SYMATTR InstName R67
SYMATTR Value 100k
SYMBOL res -1760 -688 R0
SYMATTR InstName R68
SYMATTR Value 0.01
SYMBOL current -1824 -736 R180
WINDOW 0 24 80 Left 2
WINDOW 3 24 0 Left 2
WINDOW 123 0 0 Left 2
WINDOW 39 0 0 Left 2
SYMATTR InstName I29
SYMATTR Value {current/7}
SYMBOL res -1680 -816 R0
SYMATTR InstName R69
SYMATTR Value 100k
SYMBOL res -1760 -960 R0
SYMATTR InstName R70
SYMATTR Value 0.01
SYMBOL current -1824 -1008 R180
WINDOW 0 24 80 Left 2
WINDOW 3 24 0 Left 2
WINDOW 123 0 0 Left 2
WINDOW 39 0 0 Left 2
SYMATTR InstName I30
SYMATTR Value {current/7}
SYMBOL res -1680 -1088 R0
SYMATTR InstName R71
SYMATTR Value 100k
SYMBOL res -1760 -1232 R0
SYMATTR InstName R72
SYMATTR Value 0.01
SYMBOL res -1568 -992 R90
WINDOW 0 0 56 VBottom 2
WINDOW 3 32 56 VTop 2
SYMATTR InstName R73
SYMATTR Value 0.01
SYMBOL res -1568 -720 R90
WINDOW 0 0 56 VBottom 2
WINDOW 3 32 56 VTop 2
SYMATTR InstName R74
SYMATTR Value 0.01
SYMBOL res -1568 -448 R90
WINDOW 0 0 56 VBottom 2
WINDOW 3 32 56 VTop 2
SYMATTR InstName R75
SYMATTR Value 0.01
SYMBOL res -1568 -176 R90
WINDOW 0 0 56 VBottom 2
WINDOW 3 32 56 VTop 2
SYMATTR InstName R76
SYMATTR Value 0.01
SYMBOL res -1296 -992 R90
WINDOW 0 0 56 VBottom 2
WINDOW 3 32 56 VTop 2
SYMATTR InstName R77
SYMATTR Value 0.01
SYMBOL res -1296 -720 R90
WINDOW 0 0 56 VBottom 2
WINDOW 3 32 56 VTop 2
SYMATTR InstName R78
SYMATTR Value 0.01
SYMBOL res -1296 -448 R90
WINDOW 0 0 56 VBottom 2
WINDOW 3 32 56 VTop 2
SYMATTR InstName R79
SYMATTR Value 0.01
SYMBOL res -1296 -176 R90
WINDOW 0 0 56 VBottom 2
WINDOW 3 32 56 VTop 2
SYMATTR InstName R80
SYMATTR Value 0.01
SYMBOL current -2112 80 R180
WINDOW 0 24 80 Left 2
WINDOW 3 24 0 Left 2
WINDOW 123 0 0 Left 2
WINDOW 39 0 0 Left 2
SYMATTR InstName I31
SYMATTR Value {current/7}
SYMBOL res -1968 0 R0
SYMATTR InstName R81
SYMATTR Value 100k
SYMBOL res -2048 -144 R0
SYMATTR InstName R82
SYMATTR Value 0.01
SYMBOL current -2112 -192 R180
WINDOW 0 24 80 Left 2
WINDOW 3 24 0 Left 2
WINDOW 123 0 0 Left 2
WINDOW 39 0 0 Left 2
SYMATTR InstName I32
SYMATTR Value {current/7}
SYMBOL res -1968 -272 R0
SYMATTR InstName R83
SYMATTR Value 100k
SYMBOL res -2048 -416 R0
SYMATTR InstName R84
SYMATTR Value 0.01
SYMBOL current -2112 -464 R180
WINDOW 0 24 80 Left 2
WINDOW 3 24 0 Left 2
WINDOW 123 0 0 Left 2
WINDOW 39 0 0 Left 2
SYMATTR InstName I33
SYMATTR Value {current/7}
SYMBOL res -1968 -544 R0
SYMATTR InstName R85
SYMATTR Value 100k
SYMBOL res -2048 -688 R0
SYMATTR InstName R86
SYMATTR Value 0.01
SYMBOL current -2112 -736 R180
WINDOW 0 24 80 Left 2
WINDOW 3 24 0 Left 2
WINDOW 123 0 0 Left 2
WINDOW 39 0 0 Left 2
SYMATTR InstName I34
SYMATTR Value {current/7}
SYMBOL res -1968 -816 R0
SYMATTR InstName R87
SYMATTR Value 100k
SYMBOL res -2048 -960 R0
SYMATTR InstName R88
SYMATTR Value 0.01
SYMBOL current -2112 -1008 R180
WINDOW 0 24 80 Left 2
WINDOW 3 24 0 Left 2
WINDOW 123 0 0 Left 2
WINDOW 39 0 0 Left 2
SYMATTR InstName I35
SYMATTR Value {current/7}
SYMBOL res -1968 -1088 R0
SYMATTR InstName R89
SYMATTR Value 100k
SYMBOL res -2048 -1232 R0
SYMATTR InstName R90
SYMATTR Value 0.01
SYMBOL res -1856 -992 R90
WINDOW 0 0 56 VBottom 2
WINDOW 3 32 56 VTop 2
SYMATTR InstName R91
SYMATTR Value 0.01
SYMBOL res -1856 -720 R90
WINDOW 0 0 56 VBottom 2
WINDOW 3 32 56 VTop 2
SYMATTR InstName R92
SYMATTR Value 0.01
SYMBOL res -1856 -448 R90
WINDOW 0 0 56 VBottom 2
WINDOW 3 32 56 VTop 2
SYMATTR InstName R93
SYMATTR Value 0.01
SYMBOL res -1856 -176 R90
WINDOW 0 0 56 VBottom 2
WINDOW 3 32 56 VTop 2
SYMATTR InstName R94
SYMATTR Value 0.01
SYMBOL zener -944 16 R0
WINDOW 0 -16 20 VRight 2
WINDOW 3 52 99 VLeft 2
SYMATTR InstName D3
SYMATTR Value SolarArrayDiode
SYMATTR Description Diode
SYMATTR Type diode
SYMBOL zener -1216 16 R0
WINDOW 0 -16 20 VRight 2
WINDOW 3 52 99 VLeft 2
SYMATTR InstName D4
SYMATTR Value SolarArrayDiode
SYMATTR Description Diode
SYMATTR Type diode
SYMBOL zener -1488 16 R0
WINDOW 0 -16 20 VRight 2
WINDOW 3 52 99 VLeft 2
SYMATTR InstName D5
SYMATTR Value SolarArrayDiode
SYMATTR Description Diode
SYMATTR Type diode
SYMBOL zener -1760 16 R0
WINDOW 0 -16 20 VRight 2
WINDOW 3 52 99 VLeft 2
SYMATTR InstName D6
SYMATTR Value SolarArrayDiode
SYMATTR Description Diode
SYMATTR Type diode
SYMBOL zener -2048 16 R0
WINDOW 0 -16 20 VRight 2
WINDOW 3 52 99 VLeft 2
SYMATTR InstName D7
SYMATTR Value SolarArrayDiode
SYMATTR Description Diode
SYMATTR Type diode
SYMBOL zener -2048 -256 R0
WINDOW 0 -16 20 VRight 2
WINDOW 3 52 99 VLeft 2
SYMATTR InstName D8
SYMATTR Value SolarArrayDiode
SYMATTR Description Diode
SYMATTR Type diode
SYMBOL zener -1760 -256 R0
WINDOW 0 -16 20 VRight 2
WINDOW 3 52 99 VLeft 2
SYMATTR InstName D9
SYMATTR Value SolarArrayDiode
SYMATTR Description Diode
SYMATTR Type diode
SYMBOL zener -1488 -256 R0
WINDOW 0 -16 20 VRight 2
WINDOW 3 52 99 VLeft 2
SYMATTR InstName D10
SYMATTR Value SolarArrayDiode
SYMATTR Description Diode
SYMATTR Type diode
SYMBOL zener -1216 -256 R0
WINDOW 0 -16 20 VRight 2
WINDOW 3 52 99 VLeft 2
SYMATTR InstName D11
SYMATTR Value SolarArrayDiode
SYMATTR Description Diode
SYMATTR Type diode
SYMBOL zener -944 -256 R0
WINDOW 0 -16 20 VRight 2
WINDOW 3 52 99 VLeft 2
SYMATTR InstName D12
SYMATTR Value SolarArrayDiode
SYMATTR Description Diode
SYMATTR Type diode
SYMBOL zener -672 -256 R0
WINDOW 0 -16 20 VRight 2
WINDOW 3 52 99 VLeft 2
SYMATTR InstName D13
SYMATTR Value SolarArrayDiode
SYMATTR Description Diode
SYMATTR Type diode
SYMBOL zener -400 -256 R0
WINDOW 0 -16 20 VRight 2
WINDOW 3 52 99 VLeft 2
SYMATTR InstName D14
SYMATTR Value SolarArrayDiode
SYMATTR Description Diode
SYMATTR Type diode
SYMBOL zener -400 -528 R0
WINDOW 0 -16 20 VRight 2
WINDOW 3 52 99 VLeft 2
SYMATTR InstName D15
SYMATTR Value SolarArrayDiode
SYMATTR Description Diode
SYMATTR Type diode
SYMBOL zener -672 -528 R0
WINDOW 0 -16 20 VRight 2
WINDOW 3 52 99 VLeft 2
SYMATTR InstName D16
SYMATTR Value SolarArrayDiode
SYMATTR Description Diode
SYMATTR Type diode
SYMBOL zener -944 -528 R0
WINDOW 0 -16 20 VRight 2
WINDOW 3 52 99 VLeft 2
SYMATTR InstName D17
SYMATTR Value SolarArrayDiode
SYMATTR Description Diode
SYMATTR Type diode
SYMBOL zener -1216 -528 R0
WINDOW 0 -16 20 VRight 2
WINDOW 3 52 99 VLeft 2
SYMATTR InstName D18
SYMATTR Value SolarArrayDiode
SYMATTR Description Diode
SYMATTR Type diode
SYMBOL zener -1488 -528 R0
WINDOW 0 -16 20 VRight 2
WINDOW 3 52 99 VLeft 2
SYMATTR InstName D19
SYMATTR Value SolarArrayDiode
SYMATTR Description Diode
SYMATTR Type diode
SYMBOL zener -1760 -528 R0
WINDOW 0 -16 20 VRight 2
WINDOW 3 52 99 VLeft 2
SYMATTR InstName D20
SYMATTR Value SolarArrayDiode
SYMATTR Description Diode
SYMATTR Type diode
SYMBOL zener -2048 -528 R0
WINDOW 0 -16 20 VRight 2
WINDOW 3 52 99 VLeft 2
SYMATTR InstName D21
SYMATTR Value SolarArrayDiode
SYMATTR Description Diode
SYMATTR Type diode
SYMBOL zener -2048 -800 R0
WINDOW 0 -16 20 VRight 2
WINDOW 3 52 99 VLeft 2
SYMATTR InstName D22
SYMATTR Value SolarArrayDiode
SYMATTR Description Diode
SYMATTR Type diode
SYMBOL zener -1760 -800 R0
WINDOW 0 -16 20 VRight 2
WINDOW 3 52 99 VLeft 2
SYMATTR InstName D23
SYMATTR Value SolarArrayDiode
SYMATTR Description Diode
SYMATTR Type diode
SYMBOL zener -1488 -800 R0
WINDOW 0 -16 20 VRight 2
WINDOW 3 52 99 VLeft 2
SYMATTR InstName D24
SYMATTR Value SolarArrayDiode
SYMATTR Description Diode
SYMATTR Type diode
SYMBOL zener -1216 -800 R0
WINDOW 0 -16 20 VRight 2
WINDOW 3 52 99 VLeft 2
SYMATTR InstName D25
SYMATTR Value SolarArrayDiode
SYMATTR Description Diode
SYMATTR Type diode
SYMBOL zener -944 -800 R0
WINDOW 0 -16 20 VRight 2
WINDOW 3 52 99 VLeft 2
SYMATTR InstName D26
SYMATTR Value SolarArrayDiode
SYMATTR Description Diode
SYMATTR Type diode
SYMBOL zener -672 -800 R0
WINDOW 0 -16 20 VRight 2
WINDOW 3 52 99 VLeft 2
SYMATTR InstName D27
SYMATTR Value SolarArrayDiode
SYMATTR Description Diode
SYMATTR Type diode
SYMBOL zener -400 -800 R0
WINDOW 0 -16 20 VRight 2
WINDOW 3 52 99 VLeft 2
SYMATTR InstName D28
SYMATTR Value SolarArrayDiode
SYMATTR Description Diode
SYMATTR Type diode
SYMBOL zener -400 -1072 R0
WINDOW 0 -16 20 VRight 2
WINDOW 3 52 99 VLeft 2
SYMATTR InstName D29
SYMATTR Value SolarArrayDiode
SYMATTR Description Diode
SYMATTR Type diode
SYMBOL zener -672 -1072 R0
WINDOW 0 -16 20 VRight 2
WINDOW 3 52 99 VLeft 2
SYMATTR InstName D30
SYMATTR Value SolarArrayDiode
SYMATTR Description Diode
SYMATTR Type diode
SYMBOL zener -944 -1072 R0
WINDOW 0 -16 20 VRight 2
WINDOW 3 52 99 VLeft 2
SYMATTR InstName D31
SYMATTR Value SolarArrayDiode
SYMATTR Description Diode
SYMATTR Type diode
SYMBOL zener -1216 -1072 R0
WINDOW 0 -16 20 VRight 2
WINDOW 3 52 99 VLeft 2
SYMATTR InstName D32
SYMATTR Value SolarArrayDiode
SYMATTR Description Diode
SYMATTR Type diode
SYMBOL zener -1488 -1072 R0
WINDOW 0 -16 20 VRight 2
WINDOW 3 52 99 VLeft 2
SYMATTR InstName D33
SYMATTR Value SolarArrayDiode
SYMATTR Description Diode
SYMATTR Type diode
SYMBOL zener -1760 -1072 R0
WINDOW 0 -16 20 VRight 2
WINDOW 3 52 99 VLeft 2
SYMATTR InstName D34
SYMATTR Value SolarArrayDiode
SYMATTR Description Diode
SYMATTR Type diode
SYMBOL zener -2048 -1072 R0
WINDOW 0 -16 20 VRight 2
WINDOW 3 52 99 VLeft 2
SYMATTR InstName D35
SYMATTR Value SolarArrayDiode
SYMATTR Description Diode
SYMATTR Type diode

The netlist it stands for:
* Uklad.asc
V1 N001 0 4.5
XX2 N001 N004 solar
R1 N004 0 40
XU1 N006 N008 COM 0 N007 LTC6078  ; LTC6079, pins In+ In- V+ V- OUT
R2 0 N008 1k
R3 N008 N007 26.1k
C1 OUT 0 10n
R4 N007 OUT 1k
R_analog_switch_1 PT1000_1 N006 3
C2 N008 N007 10n
XU2 N005 N003 COM 0 N002 LTC6078  ; LTC6079, pins In+ In- V+ V- OUT
R5 0 N003 26.1k
R6 N003 N002 10k
C3 OUT 0 10n
R7 N002 OUT 1k
R_analog_switch_2 N004 N005 3
C4 N003 N002 10n
V2 COM 0 5 Rser=0.1

* block symbol definitions
.subckt solar hot cold
I1 cold N063 {current/7}
D1 N063 cold SolarArrayDiode
R1 N063 cold 100k
R2 N056 N063 0.01
I2 N056 N049 {current/7}
R3 N049 N056 100k
R4 N042 N049 0.01
I3 N042 N035 {current/7}
R5 N035 N042 100k
R6 N028 N035 0.01
I4 N028 N021 {current/7}
R7 N021 N028 100k
R8 N014 N021 0.01
I5 N014 N007 {current/7}
R9 N007 N014 100k
R10 hot N007 0.01
I6 cold N062 {current/7}
D2 N062 cold SolarArrayDiode
R11 N062 cold 100k
R12 N055 N062 0.01
I7 N055 N048 {current/7}
R13 N048 N055 100k
R14 N041 N048 0.01
I8 N041 N034 {current/7}
R15 N034 N041 100k
R16 N027 N034 0.01
I9 N027 N020 {current/7}
R17 N020 N027 100k
R18 N013 N020 0.01
I10 N013 N006 {current/7}
R19 N006 N013 100k
R20 hot N006 0.01
R21 N014 N013 0.01
R22 N028 N027 0.01
R23 N042 N041 0.01
R24 N056 N055 0.01
I11 cold N061 {current/7}
R25 N061 cold 100k
R26 N054 N061 0.01
I12 N054 N047 {current/7}
R27 N047 N054 100k
R28 N040 N047 0.01
I13 N040 N033 {current/7}
R29 N033 N040 100k
R30 N026 N033 0.01
I14 N026 N019 {current/7}
R31 N019 N026 100k
R32 N012 N019 0.01
I15 N012 N005 {current/7}
R33 N005 N012 100k
R34 hot N005 0.01
I16 cold N060 {current/7}
R35 N060 cold 100k
R36 N053 N060 0.01
I17 N053 N046 {current/7}
R37 N046 N053 100k
R38 N039 N046 0.01
I18 N039 N032 {current/7}
R39 N032 N039 100k
R40 N025 N032 0.01
I19 N025 N018 {current/7}
R41 N018 N025 100k
R42 N011 N018 0.01
I20 N011 N004 {current/7}
R43 N004 N011 100k
R44 hot N004 0.01
R45 N012 N011 0.01
R46 N026 N025 0.01
R47 N040 N039 0.01
R48 N054 N053 0.01
R49 N013 N012 0.01
R50 N027 N026 0.01
R51 N041 N040 0.01
R52 N055 N054 0.01
I21 cold N059 {current/7}
R53 N059 cold 100k
R54 N052 N059 0.01
I22 N052 N045 {current/7}
R55 N045 N052 100k
R56 N038 N045 0.01
I23 N038 N031 {current/7}
R57 N031 N038 100k
R58 N024 N031 0.01
I24 N024 N017 {current/7}
R59 N017 N024 100k
R60 N010 N017 0.01
I25 N010 N003 {current/7}
R61 N003 N010 100k
R62 hot N003 0.01
I26 cold N058 {current/7}
R63 N058 cold 100k
R64 N051 N058 0.01
I27 N051 N044 {current/7}
R65 N044 N051 100k
R66 N037 N044 0.01
I28 N037 N030 {current/7}
R67 N030 N037 100k
R68 N023 N030 0.01
I29 N023 N016 {current/7}
R69 N016 N023 100k
R70 N009 N016 0.01
I30 N009 N002 {current/7}
R71 N002 N009 100k
R72 hot N002 0.01
R73 N010 N009 0.01
R74 N024 N023 0.01
R75 N038 N037 0.01
R76 N052 N051 0.01
R77 N011 N010 0.01
R78 N025 N024 0.01
R79 N039 N038 0.01
R80 N053 N052 0.01
I31 cold N057 {current/7}
R81 N057 cold 100k
R82 N050 N057 0.01
I32 N050 N043 {current/7}
R83 N043 N050 100k
R84 N036 N043 0.01
I33 N036 N029 {current/7}
R85 N029 N036 100k
R86 N022 N029 0.01
I34 N022 N015 {current/7}
R87 N015 N022 100k
R88 N008 N015 0.01
I35 N008 N001 {current/7}
R89 N001 N008 100k
R90 hot N001 0.01
R91 N009 N008 0.01
R92 N023 N022 0.01
R93 N037 N036 0.01
R94 N051 N050 0.01
D3 N061 cold SolarArrayDiode
D4 N060 cold SolarArrayDiode
D5 N059 cold SolarArrayDiode
D6 N058 cold SolarArrayDiode
D7 N057 cold SolarArrayDiode
D8 N043 N050 SolarArrayDiode
D9 N044 N051 SolarArrayDiode
D10 N045 N052 SolarArrayDiode
D11 N046 N053 SolarArrayDiode
D12 N047 N054 SolarArrayDiode
D13 N048 N055 SolarArrayDiode
D14 N049 N056 SolarArrayDiode
D15 N035 N042 SolarArrayDiode
D16 N034 N041 SolarArrayDiode
D17 N033 N040 SolarArrayDiode
D18 N032 N039 SolarArrayDiode
D19 N031 N038 SolarArrayDiode
D20 N030 N037 SolarArrayDiode
D21 N029 N036 SolarArrayDiode
D22 N015 N022 SolarArrayDiode
D23 N016 N023 SolarArrayDiode
D24 N017 N024 SolarArrayDiode
D25 N018 N025 SolarArrayDiode
D26 N019 N026 SolarArrayDiode
D27 N020 N027 SolarArrayDiode
D28 N021 N028 SolarArrayDiode
D29 N007 N014 SolarArrayDiode
D30 N006 N013 SolarArrayDiode
D31 N005 N012 SolarArrayDiode
D32 N004 N011 SolarArrayDiode
D33 N003 N010 SolarArrayDiode
D34 N002 N009 SolarArrayDiode
D35 N001 N008 SolarArrayDiode
.ends solar

.model D D
.lib standard.dio
.step param current 0 70m 10m
.step temp -50 100 30
.tran 100m
.lib LTC5.lib
.backanno
.end